# Altium project OrangeCrab.PrjPcb (part 1 of 2)
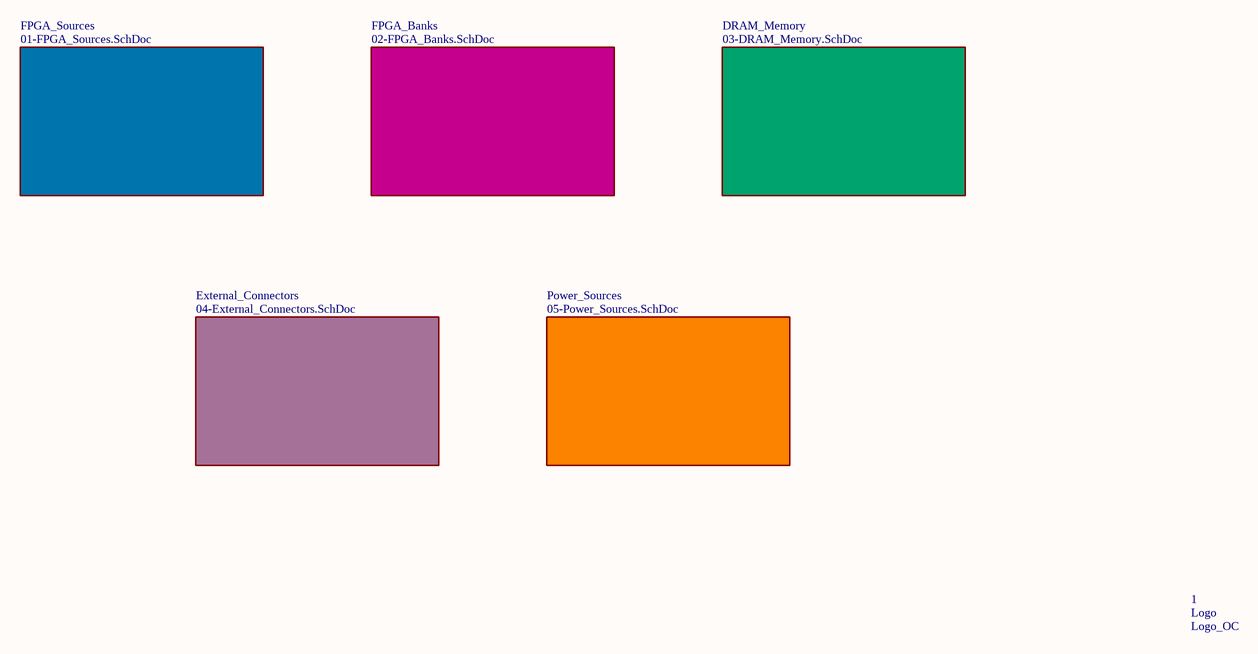
[diagram p0: 00-Hierarchy.SchDoc]
6 sheets, 143 parts. Net scope: global (net labels, ports and power ports of the same name join across sheets).
Board file: PCB_Design.PcbDoc
Sheets:
  00-Hierarchy.SchDoc
    FPGA_Sources = 01-FPGA_Sources.SchDoc
    FPGA_Banks = 02-FPGA_Banks.SchDoc
    DRAM_Memory = 03-DRAM_Memory.SchDoc
    External_Connectors = 04-External_Connectors.SchDoc
    Power_Sources = 05-Power_Sources.SchDoc

## Sheet 00-Hierarchy.SchDoc
size A4; Author: Fabian Castaño; CompanyName: GIBIC Tech-Hub; Engineer: Fabian Castaño; Organization: Universidad de Antioquia; Address1: UdeA; Address2: Medellín; Address3: Antioquia; Address4: Colombia 050010

### Parts
1  Logo_OC  [PCBComponent_1]

### Sub-sheets
DRAM_Memory = 03-DRAM_Memory.SchDoc: no entries
External_Connectors = 04-External_Connectors.SchDoc: no entries
FPGA_Banks = 02-FPGA_Banks.SchDoc: no entries
FPGA_Sources = 01-FPGA_Sources.SchDoc: no entries
Power_Sources = 05-Power_Sources.SchDoc: no entries

### Notes on the sheet
- Title
- Size:
- Date:
- A4
- Enginner:
- Time:
- Revision:
- Sheet
- of
- Author:
- File:
- (in symbol Logo_OC) Logo

## Sheet 01-FPGA_Sources.SchDoc
size A4; Author: Fabian Castaño; CompanyName: GIBIC Tech-Hub; Engineer: Fabian Castaño; Organization: Universidad de Antioquia; Address1: UdeA; Address2: Medellín; Address3: Antioquia; Address4: Colombia 050010
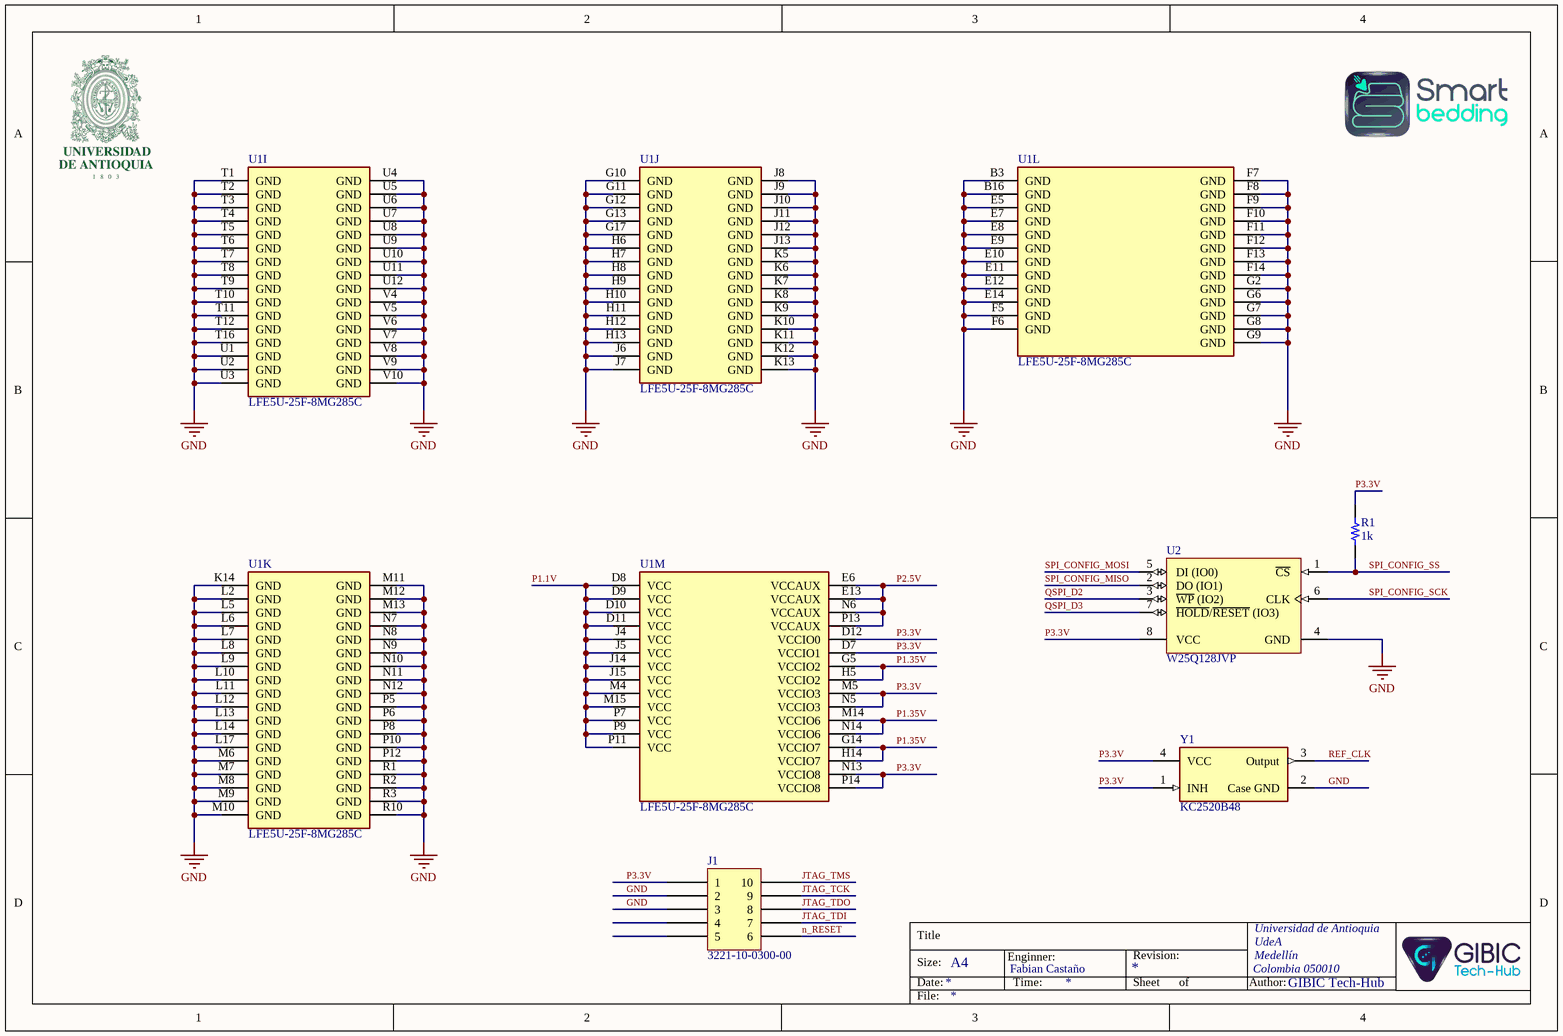
[diagram p1: 01-FPGA_Sources.SchDoc]

### Parts
J1  3221-10-0300-00  [CNC TECH 3221-10-0300-00]
R1  1k  [RES 0201_0603]
U1  LFE5U-25F-8MG285C  [FP-cBGA-LFE5U]  (parts I,J,K,L,M of 13)
U2  W25Q128JVP  [SON127P500X600X80-9N]
Y1  KC2520B48  [FP-KC2520B-MFG]

### Nets
GND: J1.2 J1.3 U1.B3(GND) U1.B16(GND) U1.E5(GND) U1.E7(GND) U1.E8(GND) U1.E9(GND) U1.E10(GND) U1.E11(GND) U1.E12(GND) U1.E14(GND) U1.F5(GND) U1.F6(GND) U1.F7(GND) U1.F8(GND) U1.F9(GND) U1.F10(GND) U1.F11(GND) U1.F12(GND) U1.F13(GND) U1.F14(GND) U1.G2(GND) U1.G6(GND) U1.G7(GND) U1.G8(GND) U1.G9(GND) U1.G10(GND) U1.G11(GND) U1.G12(GND) U1.G13(GND) U1.G17(GND) U1.H6(GND) U1.H7(GND) U1.H8(GND) U1.H9(GND) U1.H10(GND) U1.H11(GND) U1.H12(GND) U1.H13(GND) U1.J6(GND) U1.J7(GND) U1.J8(GND) U1.J9(GND) U1.J10(GND) U1.J11(GND) U1.J12(GND) U1.J13(GND) U1.K5(GND) U1.K6(GND) U1.K7(GND) U1.K8(GND) U1.K9(GND) U1.K10(GND) U1.K11(GND) U1.K12(GND) U1.K13(GND) U1.K14(GND) U1.L2(GND) U1.L5(GND) U1.L6(GND) U1.L7(GND) U1.L8(GND) U1.L9(GND) U1.L10(GND) U1.L11(GND) U1.L12(GND) U1.L13(GND) U1.L14(GND) U1.L17(GND) U1.M6(GND) U1.M7(GND) U1.M8(GND) U1.M9(GND) U1.M10(GND) U1.M11(GND) U1.M12(GND) U1.M13(GND) U1.N7(GND) U1.N8(GND) U1.N9(GND) U1.N10(GND) U1.N11(GND) U1.N12(GND) U1.P5(GND) U1.P6(GND) U1.P8(GND) U1.P10(GND) U1.P12(GND) U1.R1(GND) U1.R2(GND) U1.R3(GND) U1.R10(GND) U1.T1(GND) U1.T2(GND) U1.T3(GND) U1.T4(GND) U1.T5(GND) U1.T6(GND) U1.T7(GND) U1.T8(GND) U1.T9(GND) U1.T10(GND) U1.T11(GND) U1.T12(GND) U1.T16(GND) U1.U1(GND) U1.U2(GND) U1.U3(GND) U1.U4(GND) U1.U5(GND) U1.U6(GND) U1.U7(GND) U1.U8(GND) U1.U9(GND) U1.U10(GND) U1.U11(GND) U1.U12(GND) U1.V4(GND) U1.V5(GND) U1.V6(GND) U1.V7(GND) U1.V8(GND) U1.V9(GND) U1.V10(GND) U2.4(GND) Y1.2(Case_GND)
JTAG_TCK: J1.9
JTAG_TDI: J1.7
JTAG_TDO: J1.8
JTAG_TMS: J1.10
n_RESET: J1.6
P1.1V: U1.D8(VCC) U1.D9(VCC) U1.D10(VCC) U1.D11(VCC) U1.J4(VCC) U1.J5(VCC) U1.J14(VCC) U1.J15(VCC) U1.M4(VCC) U1.M15(VCC) U1.P7(VCC) U1.P9(VCC) U1.P11(VCC)
P1.35V: U1.G5(VCCIO2) U1.G14(VCCIO7) U1.H5(VCCIO2) U1.H14(VCCIO7) U1.M14(VCCIO6) U1.N14(VCCIO6)
P2.5V: U1.E6(VCCAUX) U1.E13(VCCAUX) U1.N6(VCCAUX) U1.P13(VCCAUX)
P3.3V: J1.1 R1.1 U1.D7(VCCIO1) U1.D12(VCCIO0) U1.M5(VCCIO3) U1.N5(VCCIO3) U1.N13(VCCIO8) U1.P14(VCCIO8) U2.8(VCC) Y1.1(INH) Y1.4(VCC)
QSPI_D2: U2.3(~{WP}_(IO2))
QSPI_D3: U2.7(~{HOLD}/~{RESET}_(IO3))
REF_CLK: Y1.3(Output)
SPI_CONFIG_MISO: U2.2(DO_(IO1))
SPI_CONFIG_MOSI: U2.5(DI_(IO0))
SPI_CONFIG_SCK: U2.6(CLK)
SPI_CONFIG_SS: R1.2 U2.1(~{CS})

Not connected (* = marked no-connect by the designer): J1 4 5

### Notes on the sheet
- Title
- Size:
- Date:
- A4
- Enginner:
- Time:
- Revision:
- Sheet
- of
- Author:
- File:

### Library data of the parts
J1 = 3221-10-0300-00: CONN HEADER SMD 10POS 1.27MM; Manufacturer: CNC Tech; Current Rating (Amps): 1A; Material Flammability Rating: UL94 V-0; Number of Positions: 10; Number of Positions Loaded: All; Pitch - Mating: 0.050" (1.27mm); Shrouding: Shrouded - 4 Wall; Style: Board to Cable/Wire; Part Number: 3221-10-0300-00; ComponentLink1Description: Datasheet; ComponentLink1URL: http://cnctech.us/idcmatching2.pdf; ComponentLink2Description: DigiKey Link; ComponentLink2URL: http://digikey.com/product-detail/en/cnc-tech/3221-10-0300-00/1175-1735-ND/4878946; Connector Type: Header; Contact Finish - Mating: Gold; Contact Finish - Post: Gold; Contact Finish Thickness - Mating: Flash; Contact Material: Brass; Contact Shape: Square; Contact Type: Male Pin; Fastening Type: Push-Pull; Features: Keying Slot; Insulation Height: 0.213" (5.40mm); Insulation Material: Polyamide (PA6T), Nylon 6T; LastUpdated: 13/01/2020 12:09:21 a. m.; Lifecycle Status: Active; Minimum Order: 1; Mounting Type: Surface Mount; Number of Rows: 2; Operating Temperature: -40°C ~ 105°C; Packaging: Tray; PartId: 109; Part Status: Active; Price: 0.73; Row Spacing - Mating: 0.050" (1.27mm); Series: -; Supplier 1: DigiKey; Supplier Part Number 1: 1175-1735-ND; Termination: Solder
R1 = ERA-1AEB103C: RES SMD 10K OHM 0.1% 1/20W 0201; Manufacturer: Panasonic Electronic Components; Power (Watts): 0.05W, 1/20W; Resistance: 10 kOhms; Temperature Coefficient: ±25ppm/°C; Part Number: ERA-1AEB103C; Value: 1k; ComponentLink1Description: Datasheet; ComponentLink1URL: https://industrial.panasonic.com/cdbs/www-data/pdf/RDM0000/AOA0000C307.pdf; ComponentLink2Description: DigiKey Link; ComponentLink2URL: https://www.digikey.com/en/products/detail/panasonic-electronic-components/ERA-1AEB103C/5035568; Composition: Thin Film; Device Package: 0201 (0603 Metric); Features: Automotive AEC-Q200; Height - Seated (Max): 0.010" (0.26mm); LastUpdated: 3/01/2023 8:15:23 p. m.; Lifecycle Status: Active; Minimum Order: 1; Number of Terminations: 2; Operating Temperature: -55°C ~ 155°C; Package / Case: 0201 (0603 Metric); Packaging: TapeAndReel; PartId: 598; Part Status: Active; Price: 0.06; Ratings: AEC-Q200; Series: ERA-1A; Size / Dimension: 0.024" L x 0.012" W (0.60mm x 0.30mm); Supplier 1: DigiKey; Supplier Part Number 1: P10KBXCT-ND; Supplier Device Package: 0201; Tolerance: ±0.1%
U1 = LFE5U-25F-8MG285C: FPGA LatticeECP5 Family 24000 Cells 40nm Technology 1.1V 285-Pin CSFBGA
U2 = W25Q128JVP: FLASH - NOR Memory IC 128Mb (16M x 8) SPI - Quad I/O, QPI, DTR 133 MHz 8-WSON (6x5)

## Sheet 02-FPGA_Banks.SchDoc
size A4; Author: Fabian Castaño; CompanyName: GIBIC Tech-Hub; Engineer: Fabian Castaño; Organization: Universidad de Antioquia; Address1: UdeA; Address2: Medellín; Address3: Antioquia; Address4: Colombia 050010
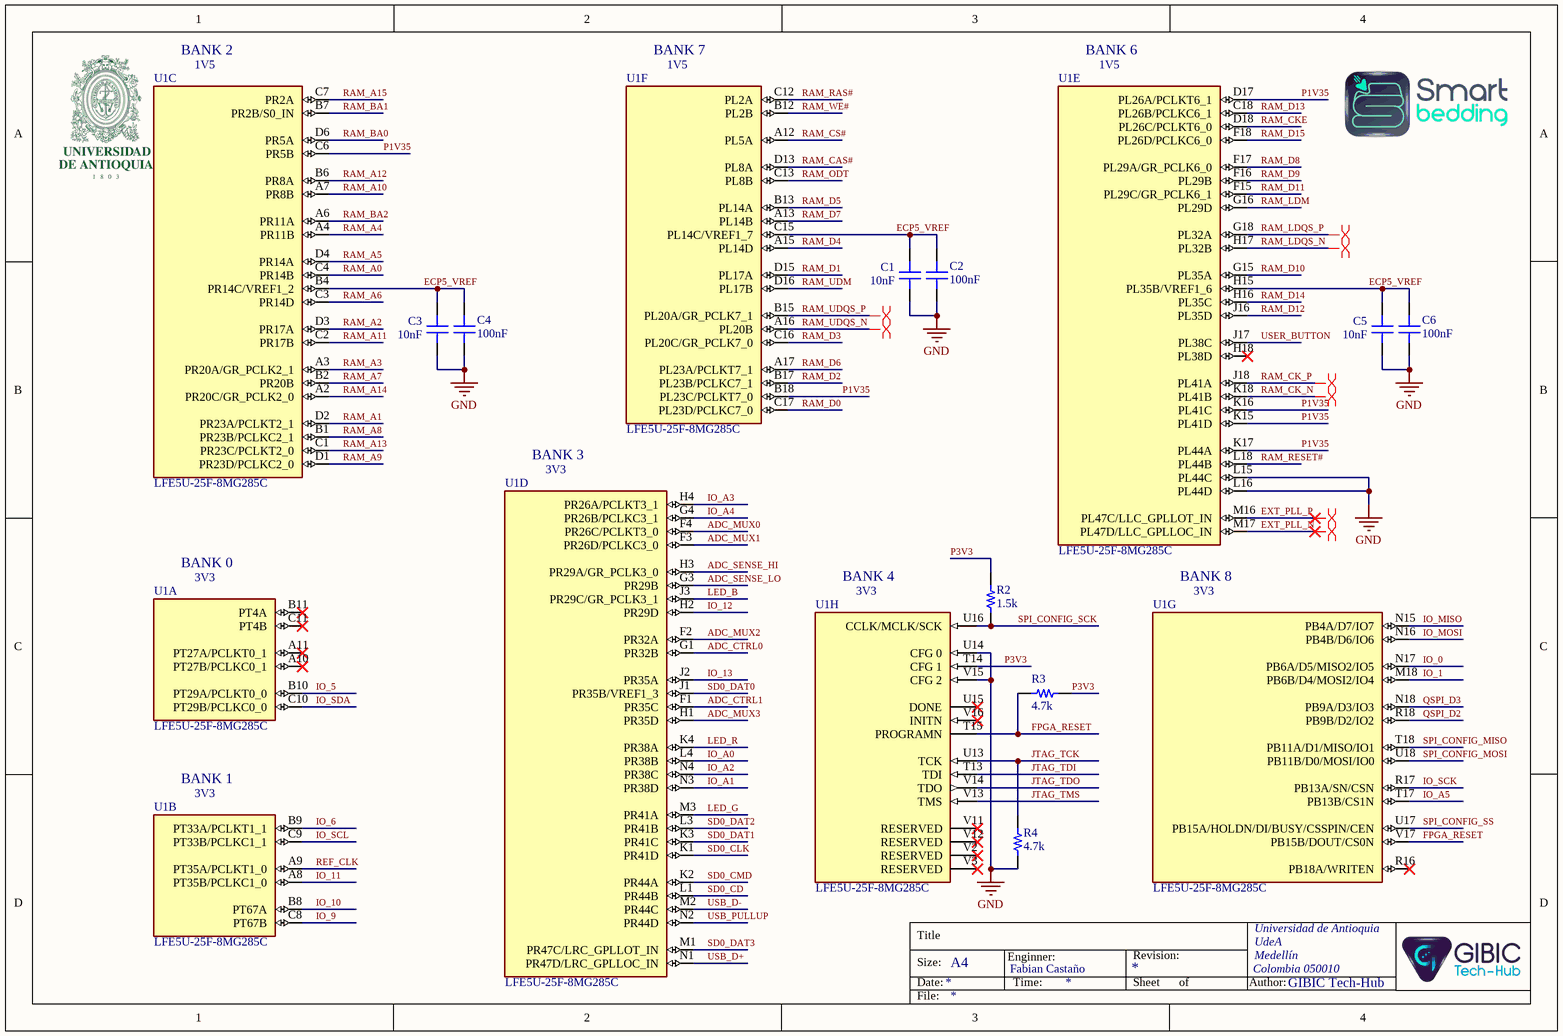
[diagram p2: 02-FPGA_Banks.SchDoc]

### Parts
C1  10nF  [CAP 0201_0603]
C2  100nF  [CAP 0201_0603]
C3  10nF  [CAP 0201_0603]
C4  100nF  [CAP 0201_0603]
C5  10nF  [CAP 0201_0603]
C6  100nF  [CAP 0201_0603]
R2  1.5k  [RES 0201_0603]
R3  4.7k  [RES 0201_0603]
R4  4.7k  [RES 0201_0603]
U1  LFE5U-25F-8MG285C  [FP-cBGA-LFE5U]  (parts A,B,C,D,E,F,G,H of 13)

### Nets
GND: C1.1 C2.1 C3.1 C4.1 C5.1 C6.1 R4.2 U1.L15(PL44C) U1.L16(PL44D) U1.U14(CFG_0) U1.V15(CFG_2)
ADC_CTRL0: U1.G1(PR32B)
ADC_CTRL1: U1.F1(PR35C)
ADC_MUX0: U1.F4(PR26C/PCLKT3_0)
ADC_MUX1: U1.F3(PR26D/PCLKC3_0)
ADC_MUX2: U1.F2(PR32A)
ADC_MUX3: U1.H1(PR35D)
ADC_SENSE_HI: U1.H3(PR29A/GR_PCLK3_0)
ADC_SENSE_LO: U1.G3(PR29B)
ECP5_VREF: C1.2 C2.2 C3.2 C4.2 C5.2 C6.2 U1.B4(PR14C/VREF1_2) U1.C15(PL14C/VREF1_7) U1.H15(PL35B/VREF1_6)
EXT_PLL_N: U1.M17(PL47D/LLC_GPLLOC_IN)
EXT_PLL_P: U1.M16(PL47C/LLC_GPLLOT_IN)
FPGA_RESET: R3.2 U1.T15(PROGRAMN) U1.V17(PB15B/DOUT/CS0N)
IO_0: U1.N17(PB6A/D5/MISO2/IO5)
IO_1: U1.M18(PB6B/D4/MOSI2/IO4)
IO_5: U1.B10(PT29A/PCLKT0_0)
IO_6: U1.B9(PT33A/PCLKT1_1)
IO_9: U1.C8(PT67B)
IO_10: U1.B8(PT67A)
IO_11: U1.A8(PT35B/PCLKC1_0)
IO_12: U1.H2(PR29D)
IO_13: U1.J2(PR35A)
IO_A0: U1.L4(PR38B)
IO_A1: U1.N3(PR38D)
IO_A2: U1.N4(PR38C)
IO_A3: U1.H4(PR26A/PCLKT3_1)
IO_A4: U1.G4(PR26B/PCLKC3_1)
IO_A5: U1.T17(PB13B/CS1N)
IO_MISO: U1.N15(PB4A/D7/IO7)
IO_MOSI: U1.N16(PB4B/D6/IO6)
IO_SCK: U1.R17(PB13A/SN/CSN)
IO_SCL: U1.C9(PT33B/PCLKC1_1)
IO_SDA: U1.C10(PT29B/PCLKC0_0)
JTAG_TCK: R4.1 U1.U13(TCK)
JTAG_TDI: U1.T13(TDI)
JTAG_TDO: U1.V14(TDO)
JTAG_TMS: U1.V13(TMS)
LED_B: U1.J3(PR29C/GR_PCLK3_1)
LED_G: U1.M3(PR41A)
LED_R: U1.K4(PR38A)
P1V35: U1.B18(PL23C/PCLKT7_0) U1.C6(PR5B) U1.D17(PL26A/PCLKT6_1) U1.K15(PL41D) U1.K16(PL41C) U1.K17(PL44A)
P3V3: R2.1 R3.1 U1.T14(CFG_1)
QSPI_D2: U1.R18(PB9B/D2/IO2)
QSPI_D3: U1.N18(PB9A/D3/IO3)
RAM_A0: U1.C4(PR14B)
RAM_A1: U1.D2(PR23A/PCLKT2_1)
RAM_A2: U1.D3(PR17A)
RAM_A3: U1.A3(PR20A/GR_PCLK2_1)
RAM_A4: U1.A4(PR11B)
RAM_A5: U1.D4(PR14A)
RAM_A6: U1.C3(PR14D)
RAM_A7: U1.B2(PR20B)
RAM_A8: U1.B1(PR23B/PCLKC2_1)
RAM_A9: U1.D1(PR23D/PCLKC2_0)
RAM_A10: U1.A7(PR8B)
RAM_A11: U1.C2(PR17B)
RAM_A12: U1.B6(PR8A)
RAM_A13: U1.C1(PR23C/PCLKT2_0)
RAM_A14: U1.A2(PR20C/GR_PCLK2_0)
RAM_A15: U1.C7(PR2A)
RAM_BA0: U1.D6(PR5A)
RAM_BA1: U1.B7(PR2B/S0_IN)
RAM_BA2: U1.A6(PR11A)
RAM_CAS#: U1.D13(PL8A)
RAM_CK_N: U1.K18(PL41B)
RAM_CK_P: U1.J18(PL41A)
RAM_CKE: U1.D18(PL26C/PCLKT6_0)
RAM_CS#: U1.A12(PL5A)
RAM_D0: U1.C17(PL23D/PCLKC7_0)
RAM_D1: U1.D15(PL17A)
RAM_D2: U1.B17(PL23B/PCLKC7_1)
RAM_D3: U1.C16(PL20C/GR_PCLK7_0)
RAM_D4: U1.A15(PL14D)
RAM_D5: U1.B13(PL14A)
RAM_D6: U1.A17(PL23A/PCLKT7_1)
RAM_D7: U1.A13(PL14B)
RAM_D8: U1.F17(PL29A/GR_PCLK6_0)
RAM_D9: U1.F16(PL29B)
RAM_D10: U1.G15(PL35A)
RAM_D11: U1.F15(PL29C/GR_PCLK6_1)
RAM_D12: U1.J16(PL35D)
RAM_D13: U1.C18(PL26B/PCLKC6_1)
RAM_D14: U1.H16(PL35C)
RAM_D15: U1.F18(PL26D/PCLKC6_0)
RAM_LDM: U1.G16(PL29D)
RAM_LDQS_N: U1.H17(PL32B)
RAM_LDQS_P: U1.G18(PL32A)
RAM_ODT: U1.C13(PL8B)
RAM_RAS#: U1.C12(PL2A)
RAM_RESET#: U1.L18(PL44B)
RAM_UDM: U1.D16(PL17B)
RAM_UDQS_N: U1.A16(PL20B)
RAM_UDQS_P: U1.B15(PL20A/GR_PCLK7_1)
RAM_WE#: U1.B12(PL2B)
REF_CLK: U1.A9(PT35A/PCLKT1_0)
SD0_CD: U1.L1(PR44B)
SD0_CLK: U1.K1(PR41D)
SD0_CMD: U1.K2(PR44A)
SD0_DAT0: U1.J1(PR35B/VREF1_3)
SD0_DAT1: U1.K3(PR41C)
SD0_DAT2: U1.L3(PR41B)
SD0_DAT3: U1.M1(PR47C/LRC_GPLLOT_IN)
SPI_CONFIG_MISO: U1.T18(PB11A/D1/MISO/IO1)
SPI_CONFIG_MOSI: U1.U18(PB11B/D0/MOSI/IO0)
SPI_CONFIG_SCK: R2.2 U1.U16(CCLK/MCLK/SCK)
SPI_CONFIG_SS: U1.U17(PB15A/HOLDN/DI/BUSY/CSSPIN/CEN)
USB_D+: U1.N1(PR47D/LRC_GPLLOC_IN)
USB_D-: U1.M2(PR44C)
USB_PULLUP: U1.N2(PR44D)
USER_BUTTON: U1.J17(PL38C)

Not connected (* = marked no-connect by the designer): U1 A10(PT27B/PCLKC0_1)* A11(PT27A/PCLKT0_1)* B11(PT4A)* C11(PT4B)* H18(PL38D)* R16(PB18A/WRITEN)* U15(DONE)* V2(RESERVED)* V3(RESERVED)* V11(RESERVED)* V12(RESERVED)* V16(INITN)*

### Layout directives
differential pair: EXT_PLL_N, EXT_PLL_P, RAM_CK_N, RAM_CK_P, RAM_LDQS_N, RAM_LDQS_P, RAM_UDQS_N, RAM_UDQS_P

### Notes on the sheet
- BANK 2
- 1V5
- BANK 7
- BANK 6
- BANK 3
- 3V3
- BANK 0
- BANK 4
- (near U1) BANK 8
- BANK 1
- Title
- Size:
- Date:
- A4
- Enginner:
- Time:
- Revision:
- Sheet
- of
- Author:
- File:

### Library data of the parts
C1 C3 C5 = 0201ZC103JAT2A: CAP CER 10000PF 10V X7R 0201; manufacturer: AVX Corporation; Tolerance: ±5%; Part Number: 0201ZC103JAT2A; Value: 10nF; Applications: General Purpose; Capacitance: 10000pF; componentlink1description: Datasheet; componentlink1url: http://datasheets.avx.com/X7RDielectric.pdf; componentlink2description: DigiKey Link; componentlink2url: http://digikey.com/product-detail/en/avx-corporation/0201ZC103JAT2A/478-10776-1-ND/7536320; Device Package: 0201 (0603 Metric); lastupdated: 2/09/2020 12:59:12 a. m.; Lifecycle Status: Active; Minimum Order: 1; Mounting Type: Surface Mount, MLCC; Operating Temperature: -55°C ~ 125°C; Package / Case: 0201 (0603 Metric); packaging: TapeAndReel; partid: 786; Part Status: Active; price: 0.01; series: -; Size / Dimension: 0.024" L x 0.012" W (0.60mm x 0.30mm); Supplier 1: DigiKey; Supplier Part Number 1: 478-10776-1-ND; Temperature Coefficient: X7R; Thickness (Max): 0.013" (0.33mm); Voltage - Rated: 10V
C2 C4 C6 = GRT033C80J104KE01J: CAP CER 0.1UF 6.3V X6S 0201; manufacturer: Murata Electronics; Capacitance: 0.1 µF; Tolerance: ±10%; Part Number: GRT033C80J104KE01J; Value: 100nF; Applications: Automotive; componentlink1description: Datasheet; componentlink1url: https://search.murata.co.jp/Ceramy/image/img/A01X/G101/ENG/GRT033C80J104KE01-01.pdf; componentlink2description: DigiKey Link; componentlink2url: https://www.digikey.com/en/products/detail/murata-electronics/GRT033C80J104KE01J/13905086; Device Package: 0201 (0603 Metric); lastupdated: 3/01/2023 8:00:58 p. m.; Lifecycle Status: Active; Minimum Order: 1; Mounting Type: Surface Mount, MLCC; Operating Temperature: -55°C ~ 105°C; Package / Case: 0201 (0603 Metric); packaging: CutTape; partid: 29730; Part Status: Active; price: 0.01; Ratings: AEC-Q200; series: GRT; Size / Dimension: 0.024" L x 0.012" W (0.60mm x 0.30mm); Supplier 1: DigiKey; Supplier Part Number 1: 490-GRT033C80J104KE01JCT-ND; Temperature Coefficient: X6S; Thickness (Max): 0.013" (0.33mm); Voltage - Rated: 6.3V
R2-R4 = ERA-1AEB103C: as R1 on sheet 01-FPGA_Sources; Part Number: ERA-1AEB103C; ComponentLink1Description: Datasheet; ComponentLink1URL: https://industrial.panasonic.com/cdbs/www-data/pdf/RDM0000/AOA0000C307.pdf; ComponentLink2Description: DigiKey Link; ComponentLink2URL: https://www.digikey.com/en/products/detail/panasonic-electronic-components/ERA-1AEB103C/5035568; Composition: Thin Film; Device Package: 0201 (0603 Metric); Features: Automotive AEC-Q200; Height - Seated (Max): 0.010" (0.26mm); LastUpdated: 3/01/2023 8:15:23 p. m.; Lifecycle Status: Active; Minimum Order: 1; Number of Terminations: 2; Operating Temperature: -55°C ~ 155°C; Package / Case: 0201 (0603 Metric); Packaging: TapeAndReel; PartId: 598; Part Status: Active; Price: 0.06; Ratings: AEC-Q200; Series: ERA-1A; Size / Dimension: 0.024" L x 0.012" W (0.60mm x 0.30mm); Supplier 1: DigiKey; Supplier Part Number 1: P10KBXCT-ND; Supplier Device Package: 0201; Tolerance: ±0.1%
  R2: Value: 1.5k
  R3 R4: Value: 4.7k
U1 = LFE5U-25F-8MG285C: as U1 on sheet 01-FPGA_Sources

## Sheet 03-DRAM_Memory.SchDoc
size A4; Author: Fabian Castaño; CompanyName: GIBIC Tech-Hub; Engineer: Fabian Castaño; Organization: Universidad de Antioquia; Address1: UdeA; Address2: Medellín; Address3: Antioquia; Address4: Colombia 050010
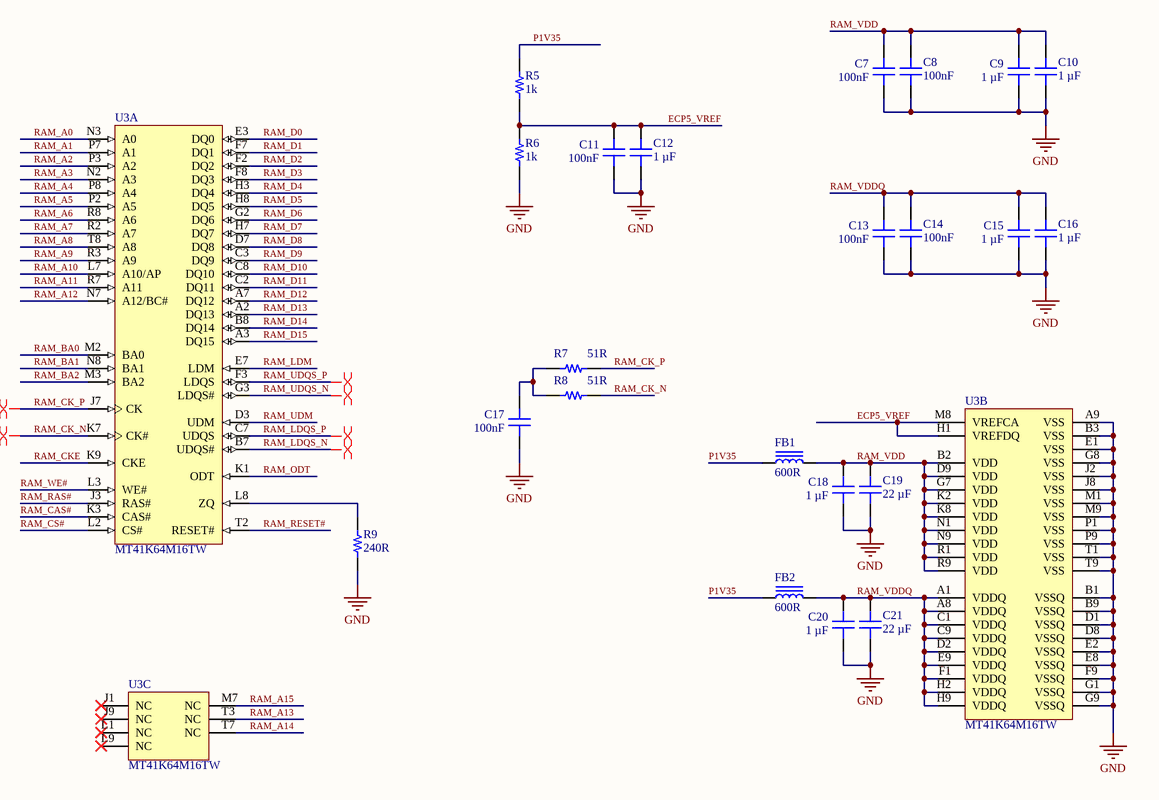
[diagram p3: 03-DRAM_Memory.SchDoc]

### Parts
C7  100nF  [CAP 0201_0603]
C8  100nF  [CAP 0201_0603]
C9  1 µF  [CAP 0402_1005]
C10  1 µF  [CAP 0402_1005]
C11  100nF  [CAP 0201_0603]
C12  1 µF  [CAP 0402_1005]
C13  100nF  [CAP 0201_0603]
C14  100nF  [CAP 0201_0603]
C15  1 µF  [CAP 0402_1005]
C16  1 µF  [CAP 0402_1005]
C17  100nF  [CAP 0201_0603]
C18  1 µF  [CAP 0402_1005]
C19  22 µF  [CAP 0603_1608]
C20  1 µF  [CAP 0402_1005]
C21  22 µF  [CAP 0603_1608]
FB1  600R  [IND 0402_1005 RF WW]
FB2  600R  [IND 0402_1005 RF WW]
R5  1k  [RES 0201_0603]
R6  1k  [RES 0201_0603]
R7  51R  [RES 0201_0603]
R8  51R  [RES 0201_0603]
R9  240R  [RES 0402_1005]
U3  MT41K64M16TW  [MICT-TW-96]  (parts A,B,C of 3)

### Nets
GND: C7.1 C8.1 C9.1 C10.1 C11.1 C12.1 C13.1 C14.1 C15.1 C16.1 C17.1 C18.1 C19.1 C20.1 C21.1 R6.2 R9.1 U3.A9(VSS) U3.B1(VSSQ) U3.B3(VSS) U3.B9(VSSQ) U3.D1(VSSQ) U3.D8(VSSQ) U3.E1(VSS) U3.E2(VSSQ) U3.E8(VSSQ) U3.F9(VSSQ) U3.G1(VSSQ) U3.G8(VSS) U3.G9(VSSQ) U3.J2(VSS) U3.J8(VSS) U3.M1(VSS) U3.M9(VSS) U3.P1(VSS) U3.P9(VSS) U3.T1(VSS) U3.T9(VSS)
ECP5_VREF: C11.2 C12.2 R5.2 R6.1 U3.H1(VREFDQ) U3.M8(VREFCA)
P1V35: FB1.1 FB2.1 R5.1
RAM_A0: U3.N3(A0)
RAM_A1: U3.P7(A1)
RAM_A2: U3.P3(A2)
RAM_A3: U3.N2(A3)
RAM_A4: U3.P8(A4)
RAM_A5: U3.P2(A5)
RAM_A6: U3.R8(A6)
RAM_A7: U3.R2(A7)
RAM_A8: U3.T8(A8)
RAM_A9: U3.R3(A9)
RAM_A10: U3.L7(A10/AP)
RAM_A11: U3.R7(A11)
RAM_A12: U3.N7(A12/BC#)
RAM_A13: U3.T3(NC)
RAM_A14: U3.T7(NC)
RAM_A15: U3.M7(NC)
RAM_BA0: U3.M2(BA0)
RAM_BA1: U3.N8(BA1)
RAM_BA2: U3.M3(BA2)
RAM_CAS#: U3.K3(CAS#)
RAM_CK_N: R8.2 U3.K7(CK#)
RAM_CK_P: R7.2 U3.J7(CK)
RAM_CKE: U3.K9(CKE)
RAM_CS#: U3.L2(CS#)
RAM_D0: U3.E3(DQ0)
RAM_D1: U3.F7(DQ1)
RAM_D2: U3.F2(DQ2)
RAM_D3: U3.F8(DQ3)
RAM_D4: U3.H3(DQ4)
RAM_D5: U3.H8(DQ5)
RAM_D6: U3.G2(DQ6)
RAM_D7: U3.H7(DQ7)
RAM_D8: U3.D7(DQ8)
RAM_D9: U3.C3(DQ9)
RAM_D10: U3.C8(DQ10)
RAM_D11: U3.C2(DQ11)
RAM_D12: U3.A7(DQ12)
RAM_D13: U3.A2(DQ13)
RAM_D14: U3.B8(DQ14)
RAM_D15: U3.A3(DQ15)
RAM_LDM: U3.E7(LDM)
RAM_LDQS_N: U3.B7(UDQS#)
RAM_LDQS_P: U3.C7(UDQS)
RAM_ODT: U3.K1(ODT)
RAM_RAS#: U3.J3(RAS#)
RAM_RESET#: U3.T2(RESET#)
RAM_UDM: U3.D3(UDM)
RAM_UDQS_N: U3.G3(LDQS#)
RAM_UDQS_P: U3.F3(LDQS)
RAM_VDD: C7.2 C8.2 C9.2 C10.2 C18.2 C19.2 FB1.2 U3.B2(VDD) U3.D9(VDD) U3.G7(VDD) U3.K2(VDD) U3.K8(VDD) U3.N1(VDD) U3.N9(VDD) U3.R1(VDD) U3.R9(VDD)
RAM_VDDQ: C13.2 C14.2 C15.2 C16.2 C20.2 C21.2 FB2.2 U3.A1(VDDQ) U3.A8(VDDQ) U3.C1(VDDQ) U3.C9(VDDQ) U3.D2(VDDQ) U3.E9(VDDQ) U3.F1(VDDQ) U3.H2(VDDQ) U3.H9(VDDQ)
RAM_WE#: U3.L3(WE#)
NetC17_2: C17.2 R7.1 R8.1
NetR9_2: R9.2 U3.L8(ZQ)

Not connected (* = marked no-connect by the designer): U3 J1(NC)* J9(NC)* L1(NC)* L9(NC)*

### Layout directives
differential pair: RAM_CK_N, RAM_CK_P, RAM_LDQS_N, RAM_LDQS_P, RAM_UDQS_N, RAM_UDQS_P

### Notes on the sheet
- Title
- Size:
- Date:
- A4
- Enginner:
- Time:
- Revision:
- Sheet
- of
- Author:
- File:

### Library data of the parts
C7 C8 C11 C13 C14 C17 = GRT033C80J104KE01J: as C2 on sheet 02-FPGA_Banks; Part Number: GRT033C80J104KE01J; Value: 100nF; Applications: Automotive; componentlink1description: Datasheet; componentlink1url: https://search.murata.co.jp/Ceramy/image/img/A01X/G101/ENG/GRT033C80J104KE01-01.pdf; componentlink2description: DigiKey Link; componentlink2url: https://www.digikey.com/en/products/detail/murata-electronics/GRT033C80J104KE01J/13905086; Device Package: 0201 (0603 Metric); lastupdated: 3/01/2023 8:00:58 p. m.; Lifecycle Status: Active; Minimum Order: 1; Mounting Type: Surface Mount, MLCC; Operating Temperature: -55°C ~ 105°C; Package / Case: 0201 (0603 Metric); packaging: CutTape; partid: 29730; Part Status: Active; price: 0.01; Ratings: AEC-Q200; series: GRT; Size / Dimension: 0.024" L x 0.012" W (0.60mm x 0.30mm); Supplier 1: DigiKey; Supplier Part Number 1: 490-GRT033C80J104KE01JCT-ND; Temperature Coefficient: X6S; Thickness (Max): 0.013" (0.33mm); Voltage - Rated: 6.3V
C9 C10 C12 C15 C16 C18 C20 = LMK105C6105KV-F: CAP CER 1UF 10V X6S 0402; manufacturer: Taiyo Yuden; Tolerance: ±10%; Part Number: LMK105C6105KV-F; Value: 1 µF; Applications: SMPS Filtering; Capacitance: 1 µF; componentlink1description: Datasheet; componentlink1url: https://www.yuden.co.jp/productdata/catalog/mlcc01_e.pdf; componentlink2description: DigiKey Link; componentlink2url: https://www.digikey.com/en/products/detail/taiyo-yuden/LMK105C6105KV-F/4157226; Device Package: 0402 (1005 Metric); lastupdated: 3/01/2023 8:04:17 p. m.; Lifecycle Status: Active; Minimum Order: 1; Mounting Type: Surface Mount, MLCC; Operating Temperature: -55°C ~ 105°C; Package / Case: 0402 (1005 Metric); packaging: TapeAndReel; partid: 2215; Part Status: Active; price: 0.01; series: M; Size / Dimension: 0.039" L x 0.020" W (1.00mm x 0.50mm); Supplier 1: DigiKey; Supplier Part Number 1: 587-3409-1-ND; Temperature Coefficient: X6S; Thickness (Max): 0.022" (0.55mm); Voltage - Rated: 10V
C19 C21 = GRM186R60J226ME15D: CAP CER 22UF 6.3V X5R 0603; manufacturer: Murata Electronics; Tolerance: ±20%; Part Number: GRM186R60J226ME15D; Value: 22 µF; Applications: General Purpose; Capacitance: 22 µF; componentlink1description: Datasheet; componentlink1url: https://psearch.en.murata.com/capacitor/product/GRM186R60J226ME15%23.pdf; componentlink2description: DigiKey Link; componentlink2url: https://www.digikey.com/en/products/detail/murata-electronics/GRM186R60J226ME15D/5877404; Device Package: 0603 (1608 Metric); lastupdated: 3/01/2023 8:07:48 p. m.; Lifecycle Status: Active; Minimum Order: 1; Mounting Type: Surface Mount, MLCC; Operating Temperature: -55°C ~ 85°C; Package / Case: 0603 (1608 Metric); packaging: TapeAndReel; partid: 2353; Part Status: Active; price: 0.06; series: GRM; Size / Dimension: 0.063" L x 0.031" W (1.60mm x 0.80mm); Supplier 1: DigiKey; Supplier Part Number 1: 490-13241-1-ND; Temperature Coefficient: X5R; Thickness (Max): 0.024" (0.60mm); Voltage - Rated: 6.3V
FB1 FB2 = LQW15AN4N8D8ZD: FIXED IND 4.8NH 1.2A 71MOHM SMD; Manufacturer: Murata Electronics; DC Resistance (DCR): 71mOhm Max; Frequency - Self Resonant: 8GHz; Inductance Frequency - Test: 100 MHz; Material - Core: Non-Magnetic; Q @ Freq: 30 @ 250MHz; Shielding: Unshielded; Tolerance: ±0.5nH; Type: Wirewound; Part Number: LQW15AN4N8D8ZD; ComponentLink1Description: Datasheet; ComponentLink1URL: https://search.murata.co.jp/Ceramy/image/img/P02/JELF243A-9138.pdf; ComponentLink2Description: DigiKey Link; ComponentLink2URL: https://www.digikey.com/en/products/detail/murata-electronics/LQW15AN4N8D8ZD/6798910; Current Rating (Amps): 1.2 A; Device Package: 0402 (1005 Metric); Height - Seated (Max): 0.024" (0.60mm); Inductance: 4.8 nH; LastUpdated: 2/01/2023 8:59:34 p. m.; Lifecycle Status: Active; Minimum Order: 1; Mounting Type: Surface Mount; Operating Temperature: -55°C ~ 125°C; Package / Case: 0402 (1005 Metric); Packaging: TapeAndReel; PartId: 2; Part Status: Active; Price: 0.08; Ratings: AEC-Q200; Series: LQW15; Size / Dimension: 0.039" L x 0.024" W (1.00mm x 0.60mm); Supplier 1: DigiKey; Supplier Part Number 1: 490-15485-1-ND; Value: 600R
R5-R8 = ERA-1AEB103C: as R1 on sheet 01-FPGA_Sources; Part Number: ERA-1AEB103C; ComponentLink1Description: Datasheet; ComponentLink1URL: https://industrial.panasonic.com/cdbs/www-data/pdf/RDM0000/AOA0000C307.pdf; ComponentLink2Description: DigiKey Link; ComponentLink2URL: https://www.digikey.com/en/products/detail/panasonic-electronic-components/ERA-1AEB103C/5035568; Composition: Thin Film; Device Package: 0201 (0603 Metric); Features: Automotive AEC-Q200; Height - Seated (Max): 0.010" (0.26mm); LastUpdated: 3/01/2023 8:15:23 p. m.; Lifecycle Status: Active; Minimum Order: 1; Number of Terminations: 2; Operating Temperature: -55°C ~ 155°C; Package / Case: 0201 (0603 Metric); Packaging: TapeAndReel; PartId: 598; Part Status: Active; Price: 0.06; Ratings: AEC-Q200; Series: ERA-1A; Size / Dimension: 0.024" L x 0.012" W (0.60mm x 0.30mm); Supplier 1: DigiKey; Supplier Part Number 1: P10KBXCT-ND; Supplier Device Package: 0201; Tolerance: ±0.1%
  R5 R6: Value: 1k
  R7 R8: Value: 51R
R9 = ERJ-2RKF1240X: RES SMD 124 OHM 1% 1/10W 0402; Manufacturer: Panasonic Electronic Components; Power (Watts): 0.1W, 1/10W; Resistance: 124 Ohms; Temperature Coefficient: ±100ppm/°C; Part Number: ERJ-2RKF1240X; Value: 240R; ComponentLink1Description: Datasheet; ComponentLink1URL: https://industrial.panasonic.com/cdbs/www-data/pdf/RDA0000/AOA0000C304.pdf; ComponentLink2Description: DigiKey Link; ComponentLink2URL: https://www.digikey.com/en/products/detail/panasonic-electronic-components/ERJ-2RKF1240X/192112; Composition: Thick Film; Device Package: 0402 (1005 Metric); Features: Automotive AEC-Q200; Height - Seated (Max): 0.016" (0.40mm); LastUpdated: 2/01/2023 8:21:47 p. m.; Lifecycle Status: Active; Minimum Order: 1; Number of Terminations: 2; Operating Temperature: -55°C ~ 155°C; Package / Case: 0402 (1005 Metric); Packaging: CutTape; PartId: 3785; Part Status: Active; Price: 0.01; Ratings: AEC-Q200; Series: ERJ-2RK; Size / Dimension: 0.039" L x 0.020" W (1.00mm x 0.50mm); Supplier 1: DigiKey; Supplier Part Number 1: P124LCT-ND; Supplier Device Package: 0402; Tolerance: ±1%
U3 = MT41K64M16TW: DDR3L SDRAM, 8 Meg x 16 x 8 Bank, 1.07 ns, 0 to 95 degC, 96-Ball FBGA (TW), Pb-Free

## Sheet 04-External_Connectors.SchDoc
size A4; Author: Fabian Castaño; CompanyName: GIBIC Tech-Hub; Engineer: Fabian Castaño; Organization: Universidad de Antioquia; Address1: UdeA; Address2: Medellín; Address3: Antioquia; Address4: Colombia 050010
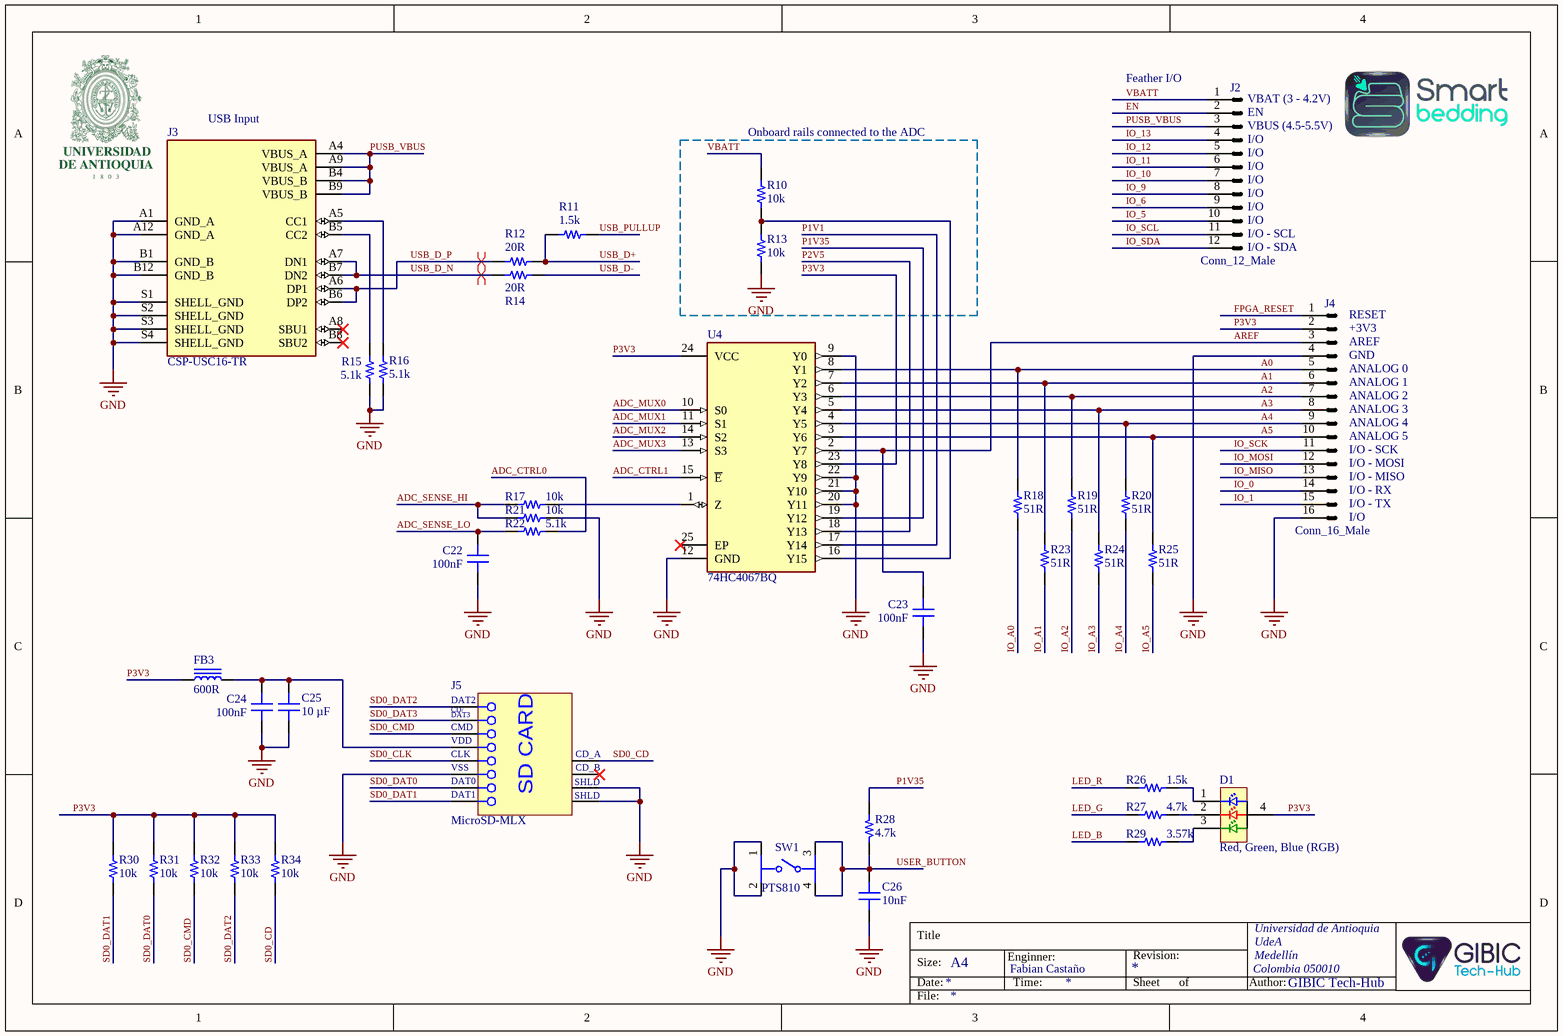
[diagram p4: 04-External_Connectors.SchDoc]

### Parts
C22  100nF  [CAP 0201_0603]
C23  100nF  [CAP 0201_0603]
C24  100nF  [CAP 0201_0603]
C25  10 µF  [CAP 0402_1005]
C26  10nF  [CAP 0201_0603]
D1  Red, Green, Blue (RGB)  [Citizen CL-505S-X-SD-T]
FB3  600R  [IND 0402_1005 RF WW]
J2  Conn_12_Male  [Conn_12_Male]
J3  CSP-USC16-TR  [VALCON_CSP-USC16-TR]
J4  Conn_16_Male  [CONN_16_MALE]
J5  MicroSD-MLX  [MOLEX-MicroSd]
R10  10k  [RES 0201_0603]
R11  1.5k  [RES 0201_0603]
R12  20R  [RES 0201_0603]
R13  10k  [RES 0201_0603]
R14  20R  [RES 0201_0603]
R15  5.1k  [RES 0201_0603]
R16  5.1k  [RES 0201_0603]
R17  10k  [RES 0201_0603]
R18  51R  [RES 0201_0603]
R19  51R  [RES 0201_0603]
R20  51R  [RES 0201_0603]
R21  10k  [RES 0201_0603]
R22  5.1k  [RES 0201_0603]
R23  51R  [RES 0201_0603]
R24  51R  [RES 0201_0603]
R25  51R  [RES 0201_0603]
R26  1.5k  [RES 0201_0603]
R27  4.7k  [RES 0201_0603]
R28  4.7k  [RES 0201_0603]
R29  3.57k  [RES 0201_0603]
R30  10k  [RES 0201_0603]
R31  10k  [RES 0201_0603]
R32  10k  [RES 0201_0603]
R33  10k  [RES 0201_0603]
R34  10k  [RES 0201_0603]
SW1  PTS810  [PCBComponent_1]
U4  74HC4067BQ  [QFN50P550X350X100-25N410X210]

### Blocks framed on the sheet
Onboard rails connected to the ADC: R10 R13

### Nets
GND: C22.1 C23.1 C24.1 C25.1 C26.1 J3.A1(GND_A) J3.A12(GND_A) J3.B1(GND_B) J3.B12(GND_B) J3.S1(SHELL_GND) J3.S2(SHELL_GND) J3.S3(SHELL_GND) J3.S4(SHELL_GND) J4.4 J4.16 J5.6(VSS) J5.11(SHLD1) J5.12(SHLD2) R13.1 R15.1 R16.1 R21.1 SW1.1 SW1.2 U4.9(Y0) U4.12(GND) U4.20(Y11) U4.21(Y10) U4.22(Y9)
A0: J4.5 R18.2 U4.8(Y1)
A1: J4.6 R23.2 U4.7(Y2)
A2: J4.7 R19.2 U4.6(Y3)
A3: J4.8 R24.2 U4.5(Y4)
A4: J4.9 R20.2 U4.4(Y5)
A5: J4.10 R25.2 U4.3(Y6)
ADC_CTRL0: R22.1
ADC_CTRL1: U4.15(~{E})
ADC_MUX0: U4.10(S0)
ADC_MUX1: U4.11(S1)
ADC_MUX2: U4.14(S2)
ADC_MUX3: U4.13(S3)
ADC_SENSE_HI: R17.2 R21.2
ADC_SENSE_LO: C22.2 R22.2
AREF: C23.2 J4.3 U4.2(Y7)
EN: J2.2
FPGA_RESET: J4.1
IO_0: J4.14
IO_1: J4.15
IO_5: J2.10
IO_6: J2.9
IO_9: J2.8
IO_10: J2.7
IO_11: J2.6
IO_12: J2.5
IO_13: J2.4
IO_A0: R18.1
IO_A1: R23.1
IO_A2: R19.1
IO_A3: R24.1
IO_A4: R20.1
IO_A5: R25.1
IO_MISO: J4.13
IO_MOSI: J4.12
IO_SCK: J4.11
IO_SCL: J2.11
IO_SDA: J2.12
LED_B: R29.2
LED_G: R27.2
LED_R: R26.2
P1V1: U4.17(Y14)
P1V35: R28.2 U4.19(Y12)
P2V5: U4.18(Y13)
P3V3: D1.4(A3) FB3.1 J4.2 R30.2 R31.2 R32.2 R33.2 R34.2 U4.23(Y8) U4.24(VCC)
PUSB_VBUS: J2.3 J3.A4(VBUS_A) J3.A9(VBUS_A) J3.B4(VBUS_B) J3.B9(VBUS_B)
SD0_CD: J5.9(CD_A) R34.1
SD0_CLK: J5.5(CLK)
SD0_CMD: J5.3(CMD) R32.1
SD0_DAT0: J5.7(DAT0) R31.1
SD0_DAT1: J5.8(DAT1) R30.1
SD0_DAT2: J5.1(DAT2) R33.1
SD0_DAT3: J5.2(CD/DAT3)
USB_D+: R11.2 R12.1
USB_D-: R14.1
USB_D_N: J3.A7(DN1) J3.B7(DN2) R14.2
USB_D_P: J3.A6(DP1) J3.B6(DP2) R12.2
USB_PULLUP: R11.1
USER_BUTTON: C26.2 R28.1 SW1.3 SW1.4
VBATT: J2.1 R10.2
NetC24_2: C24.2 C25.2 FB3.2 J5.4(VDD)
NetD1_1: D1.1(C1) R26.1
NetD1_2: D1.2(C2) R27.1
NetD1_3: D1.3(C3) R29.1
NetJ3_A5: J3.A5(CC1) R16.2
NetJ3_B5: J3.B5(CC2) R15.2
NetR10_1: R10.1 R13.2 U4.16(Y15)
NetR17_1: R17.1 U4.1(Z)

Not connected (* = marked no-connect by the designer): J3 A8(SBU1)* B8(SBU2)*; J5 10(CD_B)*; U4 25(EP)*

### Layout directives
differential pair: USB_D_N, USB_D_P

### Notes on the sheet
- (near J2) Feather I/O
- (near J2) VBAT (3 - 4.2V)
- (near J2) EN
- (near J3) USB Input
- (near J2) VBUS (4.5-5.5V)
- (near J2) I/O
- (near J2) I/O - SCL
- (near J2) I/O - SDA
- (near J4) RESET
- (near J4) +3V3
- (near J4) AREF
- (near J4) GND
- (near J4) ANALOG 0
- (near J4) ANALOG 1
- (near J4) ANALOG 2
- (near J4) ANALOG 3
- (near J4) ANALOG 4
- (near J4) ANALOG 5
- (near J4) I/O - SCK
- (near J4) I/O - MOSI
- (near J4) I/O - MISO
- (near J4) I/O - RX
- (near J4) I/O - TX
- (near J4) I/O
- Title
- Size:
- Date:
- A4
- Enginner:
- Time:
- Revision:
- Sheet
- of
- Author:
- File:
- (in symbol MicroSD-MLX) CD/; DAT3; SHLD; SD CARD

### Library data of the parts
C22-C24 = GRT033C80J104KE01J: as C2 on sheet 02-FPGA_Banks; Part Number: GRT033C80J104KE01J; Value: 100nF; Applications: Automotive; componentlink1description: Datasheet; componentlink1url: https://search.murata.co.jp/Ceramy/image/img/A01X/G101/ENG/GRT033C80J104KE01-01.pdf; componentlink2description: DigiKey Link; componentlink2url: https://www.digikey.com/en/products/detail/murata-electronics/GRT033C80J104KE01J/13905086; Device Package: 0201 (0603 Metric); lastupdated: 3/01/2023 8:00:58 p. m.; Lifecycle Status: Active; Minimum Order: 1; Mounting Type: Surface Mount, MLCC; Operating Temperature: -55°C ~ 105°C; Package / Case: 0201 (0603 Metric); packaging: CutTape; partid: 29730; Part Status: Active; price: 0.01; Ratings: AEC-Q200; series: GRT; Size / Dimension: 0.024" L x 0.012" W (0.60mm x 0.30mm); Supplier 1: DigiKey; Supplier Part Number 1: 490-GRT033C80J104KE01JCT-ND; Temperature Coefficient: X6S; Thickness (Max): 0.013" (0.33mm); Voltage - Rated: 6.3V
C25 = CL05A106MP8NUB8: CAP CER 10UF 10V X5R 0402; manufacturer: Samsung Electro-Mechanics; Tolerance: ±20%; Part Number: CL05A106MP8NUB8; Value: 10 µF; Applications: Acoustic Noise Reduction; Capacitance: 10 µF; componentlink1description: Datasheet; componentlink1url: http://www.samsungsem.com/kr/support/product-search/mlcc/CL05A106MP8NUB8.jsp; componentlink2description: DigiKey Link; componentlink2url: https://www.digikey.com/en/products/detail/samsung-electro-mechanics/CL05A106MP8NUB8/5961314; Device Package: 0402 (1005 Metric); lastupdated: 3/01/2023 8:04:20 p. m.; Lifecycle Status: Active; Minimum Order: 1; Mounting Type: Surface Mount, MLCC; Operating Temperature: -55°C ~ 85°C; Package / Case: 0402 (1005 Metric); packaging: TapeAndReel; partid: 1758; Part Status: Active; price: 0.06; series: CL; Size / Dimension: 0.039" L x 0.020" W (1.00mm x 0.50mm); Supplier 1: DigiKey; Supplier Part Number 1: 1276-6830-1-ND; Temperature Coefficient: X5R; Thickness (Max): 0.035" (0.90mm); Voltage - Rated: 10V
C26 = 0201ZC103JAT2A: as C1 on sheet 02-FPGA_Banks; Part Number: 0201ZC103JAT2A; Value: 10nF; Applications: General Purpose; Capacitance: 10000pF; componentlink1description: Datasheet; componentlink1url: http://datasheets.avx.com/X7RDielectric.pdf; componentlink2description: DigiKey Link; componentlink2url: http://digikey.com/product-detail/en/avx-corporation/0201ZC103JAT2A/478-10776-1-ND/7536320; Device Package: 0201 (0603 Metric); lastupdated: 2/09/2020 12:59:12 a. m.; Lifecycle Status: Active; Minimum Order: 1; Mounting Type: Surface Mount, MLCC; Operating Temperature: -55°C ~ 125°C; Package / Case: 0201 (0603 Metric); packaging: TapeAndReel; partid: 786; Part Status: Active; price: 0.01; series: -; Size / Dimension: 0.024" L x 0.012" W (0.60mm x 0.30mm); Supplier 1: DigiKey; Supplier Part Number 1: 478-10776-1-ND; Temperature Coefficient: X7R; Thickness (Max): 0.013" (0.33mm); Voltage - Rated: 10V
D1 = CL-505S-X-SD-T: LED TRI TOP FIRING 1.0 X 1.0; Manufacturer: Citizen; Configuration: Common Anode; Current - Test: 5mA Red, 5mA Green, 5mA Blue; Lens Color: 0.26mm; Lens Size: 1.00mm; Lens Style: Square with Flat Top; Millicandela Rating: 40mcd Red, 220mcd Green, 65mcd Blue; Voltage - Forward (Vf) (Typ): 1.85V Red, 2.7V Green, 2.75V Blue; Wavelength - Dominant: 615nm Red, 530nm Green, 470nm Blue; Part Number: CL-505S-X-SD-T; Color: Red, Green, Blue (RGB); ComponentLink1Description: Datasheet; ComponentLink1URL: http://ce.citizen.co.jp/up_img/product/sQNrj4RlM7o2/CL-505S_e.pdf; ComponentLink2Description: DigiKey Link; ComponentLink2URL: http://digikey.com/product-detail/en/citizen/CL-505S-X-SD-T/1642-1510-1-ND/6005950; Device Package: 0404 (1010 Metric); Height (Max): 0.26mm; LastUpdated: 19/03/2020 10:25:23 p. m.; Lifecycle Status: Active; Minimum Order: 1; Mounting Type: Surface Mount; Package / Case: 0404 (1010 Metric); Packaging: TapeAndReel; PartId: 955; Part Status: Active; Price: 0.23; Series: CL-505S; Size / Dimension: 1.00mm L x 1.00mm W; Supplier 1: DigiKey; Supplier Part Number 1: 1642-1510-1-ND; Value: Red, Green, Blue (RGB)
FB3 = LQW15AN4N8D8ZD: as FB1 on sheet 03-DRAM_Memory; Part Number: LQW15AN4N8D8ZD; ComponentLink1Description: Datasheet; ComponentLink1URL: https://search.murata.co.jp/Ceramy/image/img/P02/JELF243A-9138.pdf; ComponentLink2Description: DigiKey Link; ComponentLink2URL: https://www.digikey.com/en/products/detail/murata-electronics/LQW15AN4N8D8ZD/6798910; Current Rating (Amps): 1.2 A; Device Package: 0402 (1005 Metric); Height - Seated (Max): 0.024" (0.60mm); Inductance: 4.8 nH; LastUpdated: 2/01/2023 8:59:34 p. m.; Lifecycle Status: Active; Minimum Order: 1; Mounting Type: Surface Mount; Operating Temperature: -55°C ~ 125°C; Package / Case: 0402 (1005 Metric); Packaging: TapeAndReel; PartId: 2; Part Status: Active; Price: 0.08; Ratings: AEC-Q200; Series: LQW15; Size / Dimension: 0.039" L x 0.024" W (1.00mm x 0.60mm); Supplier 1: DigiKey; Supplier Part Number 1: 490-15485-1-ND; Value: 600R
J2 = Conn_12_Male: Conn_01x12_Male
J3 = CSP-USC16-TR: CSP-USC16-TR Valcon USB Type C Surface Mount PCB Socket; Package: None; Purchase-URL: https://pricing.snapeda.com/search/part/CSP-USC16-TR/?ref=eda; MP: CSP-USC16-TR; Check_prices: https://www.snapeda.com/parts/CSP-USC16-TR/Valcon/view-part/4783629/?ref=eda; MF: Valcon; Value: *; Availability: No availability data; Price: None; SnapEDA_Link: https://www.snapeda.com/parts/CSP-USC16-TR/Valcon/view-part/4783629/?ref=snap
J4 = Conn_16_Male: Conn_01x16_Male
J5 = MicroSD-MLX: Micro SD Card, RA, -25 to 85 degC, 8-Pin SMD, RoHS
R10-R34 = ERA-1AEB103C: as R1 on sheet 01-FPGA_Sources; Part Number: ERA-1AEB103C; ComponentLink1Description: Datasheet; ComponentLink1URL: https://industrial.panasonic.com/cdbs/www-data/pdf/RDM0000/AOA0000C307.pdf; ComponentLink2Description: DigiKey Link; ComponentLink2URL: https://www.digikey.com/en/products/detail/panasonic-electronic-components/ERA-1AEB103C/5035568; Composition: Thin Film; Device Package: 0201 (0603 Metric); Features: Automotive AEC-Q200; Height - Seated (Max): 0.010" (0.26mm); LastUpdated: 3/01/2023 8:15:23 p. m.; Lifecycle Status: Active; Minimum Order: 1; Number of Terminations: 2; Operating Temperature: -55°C ~ 155°C; Package / Case: 0201 (0603 Metric); Packaging: TapeAndReel; PartId: 598; Part Status: Active; Price: 0.06; Ratings: AEC-Q200; Series: ERA-1A; Size / Dimension: 0.024" L x 0.012" W (0.60mm x 0.30mm); Supplier 1: DigiKey; Supplier Part Number 1: P10KBXCT-ND; Supplier Device Package: 0201; Tolerance: ±0.1%
  R10 R13 R17 R21 R30-R34: Value: 10k
  R11 R26: Value: 1.5k
  R12 R14: Value: 20R
  R15 R16 R22: Value: 5.1k
  R18-R20 R23-R25: Value: 51R
  R27 R28: Value: 4.7k
  R29: Value: 3.57k
U4 = 74HC4067BQ: 1 Circuit IC Switch 16:1 120Ohm 24-DHVQFN _5.5x3.5_; MF: Nexperia USA; Availability: Unavailable; SnapEDA_Link: https://www.snapeda.com/parts/74HC4067BQ/Nexperia%20USA%20Inc./view-part/602696/?ref=snap; Price: None; Package: DHVQFN-24 Nexperia; MP: 74HC4067BQ; Value: *

## Sheet 05-Power_Sources.SchDoc
size A4; Author: Fabian Castaño; CompanyName: GIBIC Tech-Hub; Engineer: Fabian Castaño; Organization: Universidad de Antioquia; Address1: UdeA; Address2: Medellín; Address3: Antioquia; Address4: Colombia 050010
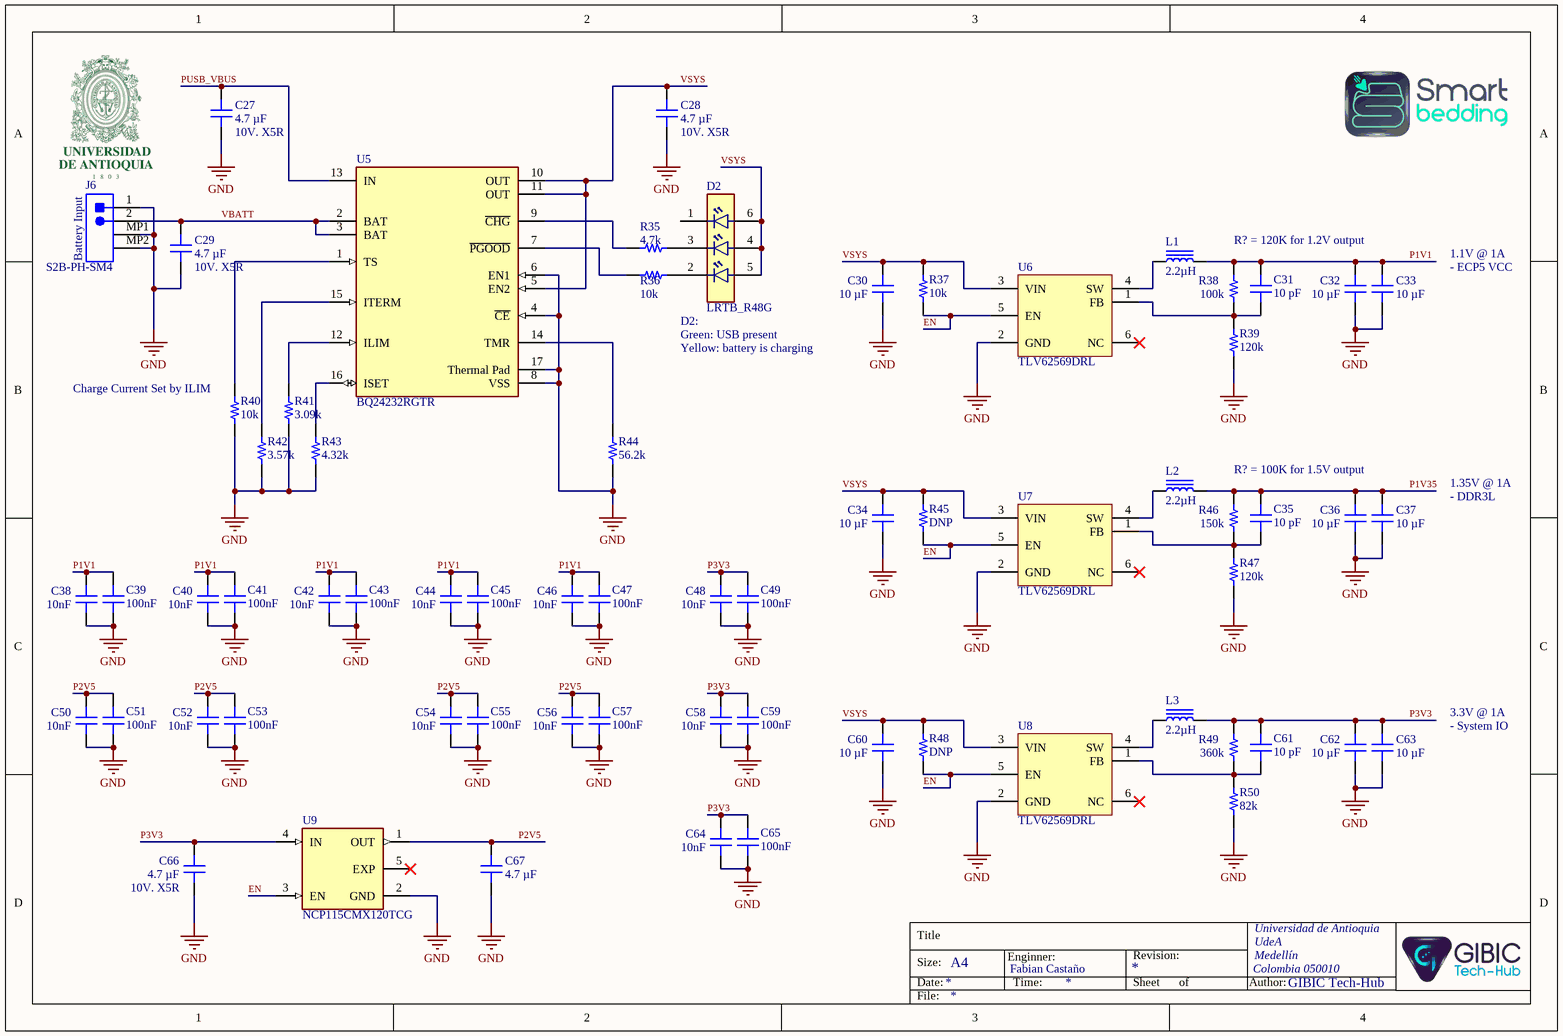
[diagram p5: 05-Power_Sources.SchDoc]

### Parts
C27  4.7 µF  Voltage: 10V. X5R  [CAP 0402_1005]
C28  4.7 µF  Voltage: 10V. X5R  [CAP 0402_1005]
C29  4.7 µF  Voltage: 10V. X5R  [CAP 0402_1005]
C30  10 µF  [CAP 0402_1005]
C31  10 pF  [CAP 0201_0603]
C32  10 µF  [CAP 0402_1005]
C33  10 µF  [CAP 0402_1005]
C34  10 µF  [CAP 0402_1005]
C35  10 pF  [CAP 0201_0603]
C36  10 µF  [CAP 0402_1005]
C37  10 µF  [CAP 0402_1005]
C38  10nF  [CAP 0201_0603]
C39  100nF  [CAP 0201_0603]
C40  10nF  [CAP 0201_0603]
C41  100nF  [CAP 0201_0603]
C42  10nF  [CAP 0201_0603]
C43  100nF  [CAP 0201_0603]
C44  10nF  [CAP 0201_0603]
C45  100nF  [CAP 0201_0603]
C46  10nF  [CAP 0201_0603]
C47  100nF  [CAP 0201_0603]
C48  10nF  [CAP 0201_0603]
C49  100nF  [CAP 0201_0603]
C50  10nF  [CAP 0201_0603]
C51  100nF  [CAP 0201_0603]
C52  10nF  [CAP 0201_0603]
C53  100nF  [CAP 0201_0603]
C54  10nF  [CAP 0201_0603]
C55  100nF  [CAP 0201_0603]
C56  10nF  [CAP 0201_0603]
C57  100nF  [CAP 0201_0603]
C58  10nF  [CAP 0201_0603]
C59  100nF  [CAP 0201_0603]
C60  10 µF  [CAP 0402_1005]
C61  10 pF  [CAP 0201_0603]
C62  10 µF  [CAP 0402_1005]
C63  10 µF  [CAP 0402_1005]
C64  10nF  [CAP 0201_0603]
C65  100nF  [CAP 0201_0603]
C66  4.7 µF  Voltage: 10V. X5R  [CAP 0402_1005]
C67  4.7 µF  [CAP 0402_1005]
D2  LRTB_R48G  [LRTB_R48G]
J6  S2B-PH-SM4  [JST-S2B-PH-SM4-TB(LF)(SN)-2_V]
L1  2.2µH  [IND 0806_2016]
L2  2.2µH  [IND 0806_2016]
L3  2.2µH  [IND 0806_2016]
R35  4.7k  [RES 0201_0603]
R36  10k  [RES 0201_0603]
R37  10k  [RES 0201_0603]
R38  100k  [RES 0201_0603]
R39  120k  [RES 0201_0603]
R40  10k  [RES 0201_0603]
R41  3.09k  [RES 0201_0603]
R42  3.57k  [RES 0201_0603]
R43  4.32k  [RES 0201_0603]
R44  56.2k  [RES 0201_0603]
R45  DNP  [RES 0201_0603]
R46  150k  [RES 0201_0603]
R47  120k  [RES 0201_0603]
R48  DNP  [RES 0201_0603]
R49  360k  [RES 0201_0603]
R50  82k  [RES 0201_0603]
U5  BQ24232RGTR  [FP-RGTR_MFG]
U6  TLV62569DRL  [SOT50P160X60-6N]
U7  TLV62569DRL  [SOT50P160X60-6N]
U8  TLV62569DRL  [SOT50P160X60-6N]
U9  NCP115CMX120TCG  [VREG_NCP115CMX120TCG]

### Nets
GND: C27.2 C28.2 C29.2 C30.1 C32.1 C33.1 C34.1 C36.1 C37.1 C38.1 C39.1 C40.1 C41.1 C42.1 C43.1 C44.1 C45.1 C46.1 C47.1 C48.1 C49.1 C50.1 C51.1 C52.1 C53.1 C54.1 C55.1 C56.1 C57.1 C58.1 C59.1 C60.1 C62.1 C63.1 C64.1 C65.1 C66.2 C67.2 J6.1 J6.MP1 J6.MP2 R39.1 R40.1 R41.1 R42.1 R43.1 R44.1 R47.1 R50.1 U5.4(~{CE}) U5.6(EN1) U5.8(VSS) U5.17(Thermal_Pad) U6.2(GND) U7.2(GND) U8.2(GND) U9.2(GND)
EN: R37.1 R45.1 R48.1 U6.5(EN) U7.5(EN) U8.5(EN) U9.3(EN)
P1V1: C31.2 C32.2 C33.2 C38.2 C39.2 C40.2 C41.2 C42.2 C43.2 C44.2 C45.2 C46.2 C47.2 L1.2 R38.2
P1V35: C35.2 C36.2 C37.2 L2.2 R46.2
P2V5: C50.2 C51.2 C52.2 C53.2 C54.2 C55.2 C56.2 C57.2 C67.1 U9.1(OUT)
P3V3: C48.2 C49.2 C58.2 C59.2 C61.2 C62.2 C63.2 C64.2 C65.2 C66.1 L3.2 R49.2 U9.4(IN)
PUSB_VBUS: C27.1 U5.13(IN)
VBATT: C29.1 J6.2 U5.2(BAT) U5.3(BAT)
VSYS: C28.1 C30.2 C34.2 C60.2 D2.4(RED_A) D2.5(GREEN_A) D2.6(BLUE_A) R37.2 R45.2 R48.2 U5.5(EN2) U5.10(OUT) U5.11(OUT) U6.3(VIN) U7.3(VIN) U8.3(VIN)
NetC31_1: C31.1 R38.1 R39.2 U6.1(FB)
NetC35_1: C35.1 R46.1 R47.2 U7.1(FB)
NetC61_1: C61.1 R49.1 R50.2 U8.1(FB)
NetD2_2: D2.2(GREEN_C) R36.1
NetD2_3: D2.3(RED_C) R35.1
NetL1_1: L1.1 U6.4(SW)
NetL2_1: L2.1 U7.4(SW)
NetL3_1: L3.1 U8.4(SW)
NetR35_2: R35.2 U5.9(~{CHG})
NetR36_2: R36.2 U5.7(~{PGOOD})
NetR40_2: R40.2 U5.1(TS)
NetR41_2: R41.2 U5.12(ILIM)
NetR42_2: R42.2 U5.15(ITERM)
NetR43_2: R43.2 U5.16(ISET)
NetR44_2: R44.2 U5.14(TMR)

Not connected (* = marked no-connect by the designer): D2 1(BLUE_C); U6 6(NC)*; U7 6(NC)*; U8 6(NC)*; U9 5(EXP)*

### Notes on the sheet
- R? = 120K for 1.2V output
- (near J6) Battery Input
- 1.1V @ 1A
- - ECP5 VCC
- D2:
- Green: USB present
- Yellow: battery is charging
- (near R40) Charge Current Set by ILIM
- R? = 100K for 1.5V output
- 1.35V @ 1A
- - DDR3L
- 3.3V @ 1A
- - System IO
- Title
- Size:
- Date:
- A4
- Enginner:
- Time:
- Revision:
- Sheet
- of
- Author:
- File:

### Library data of the parts
C27-C29 C66 C67 = C1005X6S0G475M050BC: CAP CER 4.7UF 4V X6S 0402; manufacturer: TDK Corporation; Tolerance: ±20%; Part Number: C1005X6S0G475M050BC; Value: 4.7 µF; Applications: General Purpose; Capacitance: 4.7 µF; componentlink1description: Datasheet; componentlink1url: https://product.tdk.com/info/en/catalog/datasheets/mlcc_commercial_general_en.pdf?ref_disty=digikey; componentlink2description: DigiKey Link; componentlink2url: https://www.digikey.com/en/products/detail/tdk-corporation/C1005X6S0G475M050BC/2792242; Device Package: 0402 (1005 Metric); Features: Low ESL; lastupdated: 3/01/2023 8:04:20 p. m.; Lifecycle Status: Active; Minimum Order: 1; Mounting Type: Surface Mount, MLCC; Operating Temperature: -55°C ~ 105°C; Package / Case: 0402 (1005 Metric); packaging: TapeAndReel; partid: 1756; Part Status: Active; price: 0.07; series: C; Size / Dimension: 0.039" L x 0.020" W (1.00mm x 0.50mm); Supplier 1: DigiKey; Supplier Part Number 1: 445-8017-1-ND; Temperature Coefficient: X6S; Thickness (Max): 0.026" (0.65mm); Voltage - Rated: 4V
C30 C32-C34 C36 C37 C60 C62 C63 = CL05A106MP8NUB8: as C25 on sheet 04-External_Connectors; Part Number: CL05A106MP8NUB8; Value: 10 µF; Applications: Acoustic Noise Reduction; Capacitance: 10 µF; componentlink1description: Datasheet; componentlink1url: http://www.samsungsem.com/kr/support/product-search/mlcc/CL05A106MP8NUB8.jsp; componentlink2description: DigiKey Link; componentlink2url: https://www.digikey.com/en/products/detail/samsung-electro-mechanics/CL05A106MP8NUB8/5961314; Device Package: 0402 (1005 Metric); lastupdated: 3/01/2023 8:04:20 p. m.; Lifecycle Status: Active; Minimum Order: 1; Mounting Type: Surface Mount, MLCC; Operating Temperature: -55°C ~ 85°C; Package / Case: 0402 (1005 Metric); packaging: TapeAndReel; partid: 1758; Part Status: Active; price: 0.06; series: CL; Size / Dimension: 0.039" L x 0.020" W (1.00mm x 0.50mm); Supplier 1: DigiKey; Supplier Part Number 1: 1276-6830-1-ND; Temperature Coefficient: X5R; Thickness (Max): 0.035" (0.90mm); Voltage - Rated: 10V
C31 C35 C61 = C0201C100J3GAC7867: CAP CER 10PF 25V C0G/NP0 0201; manufacturer: KEMET; Temperature Coefficient: C0G, NP0; Tolerance: ±5%; Part Number: C0201C100J3GAC7867; Value: 10 pF; Applications: General Purpose; Capacitance: 10 pF; componentlink1description: Datasheet; componentlink1url: https://api.kemet.com/component-edge/download/datasheet/C0201C100J3GAC7867.pdf; componentlink2description: DigiKey Link; componentlink2url: https://www.digikey.com/en/products/detail/kemet/C0201C100J3GAC7867/7381972; Device Package: 0201 (0603 Metric); Features: Low ESL; lastupdated: 3/01/2023 8:01:19 p. m.; Lifecycle Status: Active; Minimum Order: 1; Mounting Type: Surface Mount, MLCC; Operating Temperature: -55°C ~ 125°C; Package / Case: 0201 (0603 Metric); packaging: TapeAndReel; partid: 4; Part Status: Active; price: 0.02; series: SMD Comm C0G; Size / Dimension: 0.024" L x 0.012" W (0.60mm x 0.30mm); Supplier 1: DigiKey; Supplier Part Number 1: 399-14856-1-ND; Thickness (Max): 0.013" (0.33mm); Voltage - Rated: 25V
C38 C40 C42 C44 C46 C48 C50 C52 C54 C56 C58 C64 = 0201ZC103JAT2A: as C1 on sheet 02-FPGA_Banks; Part Number: 0201ZC103JAT2A; Value: 10nF; Applications: General Purpose; Capacitance: 10000pF; componentlink1description: Datasheet; componentlink1url: http://datasheets.avx.com/X7RDielectric.pdf; componentlink2description: DigiKey Link; componentlink2url: http://digikey.com/product-detail/en/avx-corporation/0201ZC103JAT2A/478-10776-1-ND/7536320; Device Package: 0201 (0603 Metric); lastupdated: 2/09/2020 12:59:12 a. m.; Lifecycle Status: Active; Minimum Order: 1; Mounting Type: Surface Mount, MLCC; Operating Temperature: -55°C ~ 125°C; Package / Case: 0201 (0603 Metric); packaging: TapeAndReel; partid: 786; Part Status: Active; price: 0.01; series: -; Size / Dimension: 0.024" L x 0.012" W (0.60mm x 0.30mm); Supplier 1: DigiKey; Supplier Part Number 1: 478-10776-1-ND; Temperature Coefficient: X7R; Thickness (Max): 0.013" (0.33mm); Voltage - Rated: 10V
C39 C41 C43 C45 C47 C49 C51 C53 C55 C57 C59 C65 = GRT033C80J104KE01J: as C2 on sheet 02-FPGA_Banks; Part Number: GRT033C80J104KE01J; Value: 100nF; Applications: Automotive; componentlink1description: Datasheet; componentlink1url: https://search.murata.co.jp/Ceramy/image/img/A01X/G101/ENG/GRT033C80J104KE01-01.pdf; componentlink2description: DigiKey Link; componentlink2url: https://www.digikey.com/en/products/detail/murata-electronics/GRT033C80J104KE01J/13905086; Device Package: 0201 (0603 Metric); lastupdated: 3/01/2023 8:00:58 p. m.; Lifecycle Status: Active; Minimum Order: 1; Mounting Type: Surface Mount, MLCC; Operating Temperature: -55°C ~ 105°C; Package / Case: 0201 (0603 Metric); packaging: CutTape; partid: 29730; Part Status: Active; price: 0.01; Ratings: AEC-Q200; series: GRT; Size / Dimension: 0.024" L x 0.012" W (0.60mm x 0.30mm); Supplier 1: DigiKey; Supplier Part Number 1: 490-GRT033C80J104KE01JCT-ND; Temperature Coefficient: X6S; Thickness (Max): 0.013" (0.33mm); Voltage - Rated: 6.3V
D2 = LRTB_R48G: RGB LED LRTB R48G
J6 = S2B-PH-SM4: Male Header, Pitch 2 mm, 1 x 2 Position, Height 5.5 mm
L1-L3 = ASMPM-0806-2R2M-T: FIXED IND 2.2UH 1.4A 168MOHM; Manufacturer: Abracon LLC; Current Rating (Amps): 1.6A; Current - Saturation: 2A; DC Resistance (DCR): 168mOhm Max; Inductance Frequency - Test: 100kHz; Material - Core: Ceramic; Shielding: Unshielded; Tolerance: ±20%; Type: Multilayer; Part Number: ASMPM-0806-2R2M-T; ComponentLink1Description: Datasheet; ComponentLink1URL: https://abracon.com/Magnetics/power/ASMPM.pdf; ComponentLink2Description: DigiKey Link; ComponentLink2URL: http://digikey.com/product-detail/en/abracon-llc/ASMPM-0806-2R2M-T/535-14172-1-ND/8259990; Device Package: 0806 (2016 Metric); Height - Seated (Max): 0.039" (1.00mm); Inductance: 2.2µH; LastUpdated: 2/01/2023 9:04:13 p. m.; Lifecycle Status: Active; Minimum Order: 0; Mounting Type: Surface Mount; Operating Temperature: -40°C ~ 125°C; Package / Case: 0806 (2016 Metric); Packaging: TapeAndReel; PartId: 3058; Part Status: Active; Price: 0.14; Series: ASMPM; Size / Dimension: 0.079" L x 0.063" W (2.00mm x 1.60mm); Supplier 1: DigiKey; Supplier Part Number 1: 535-14172-1-ND; Supplier Device Package: 0806 (2016 Metric); Value: 2.2µH
R35-R37 R40-R45 R48 = ERA-1AEB103C: as R1 on sheet 01-FPGA_Sources; Part Number: ERA-1AEB103C; ComponentLink1Description: Datasheet; ComponentLink1URL: https://industrial.panasonic.com/cdbs/www-data/pdf/RDM0000/AOA0000C307.pdf; ComponentLink2Description: DigiKey Link; ComponentLink2URL: https://www.digikey.com/en/products/detail/panasonic-electronic-components/ERA-1AEB103C/5035568; Composition: Thin Film; Device Package: 0201 (0603 Metric); Features: Automotive AEC-Q200; Height - Seated (Max): 0.010" (0.26mm); LastUpdated: 3/01/2023 8:15:23 p. m.; Lifecycle Status: Active; Minimum Order: 1; Number of Terminations: 2; Operating Temperature: -55°C ~ 155°C; Package / Case: 0201 (0603 Metric); Packaging: TapeAndReel; PartId: 598; Part Status: Active; Price: 0.06; Ratings: AEC-Q200; Series: ERA-1A; Size / Dimension: 0.024" L x 0.012" W (0.60mm x 0.30mm); Supplier 1: DigiKey; Supplier Part Number 1: P10KBXCT-ND; Supplier Device Package: 0201; Tolerance: ±0.1%
  R35: Value: 4.7k
  R36 R37 R40: Value: 10k
  R41: Value: 3.09k
  R42: Value: 3.57k
  R43: Value: 4.32k
  R44: Value: 56.2k
  R45 R48: Value: DNP
R38 R39 R46 R47 R49 R50 = PFR03S-104-JNH: RES SMD 100K OHM 5% 1/20W 0201; Manufacturer: Delta Electronics/Cyntec; Power (Watts): 0.05W, 1/20W; Resistance: 100 kOhms; Temperature Coefficient: ±200ppm/°C; Part Number: PFR03S-104-JNH; ComponentLink1Description: Datasheet; ComponentLink1URL: http://www.cyntec.com/upfile/products/download/RK000000NH%20_A4_PFR03S.pdf; ComponentLink2Description: DigiKey Link; ComponentLink2URL: https://www.digikey.com/en/products/detail/delta-electronics-cyntec/PFR03S-104-JNH/9761665; Composition: Thick Film; Device Package: 0201 (0603 Metric); Height - Seated (Max): 0.010" (0.26mm); LastUpdated: 3/01/2023 8:15:21 p. m.; Lifecycle Status: Active; Minimum Order: 1; Number of Terminations: 2; Operating Temperature: -55°C ~ 125°C; Package / Case: 0201 (0603 Metric); Packaging: CutTape; PartId: 917; Part Status: Active; Price: 0.01; Series: PFR03S; Size / Dimension: 0.024" L x 0.012" W (0.60mm x 0.30mm); Supplier 1: DigiKey; Supplier Part Number 1: 2037-PFR03S-104-JNHCT-ND; Supplier Device Package: 0201; Tolerance: ±5%
  R38: Value: 100k
  R39 R47: Value: 120k
  R46: Value: 150k
  R49: Value: 360k
  R50: Value: 82k
U5 = BQ24232RGTR: IC LI-ION CHARGE PWR MGMT 16QFN BQ24232RGTR
U6-U8 = TLV62569DRL: 2.5V-5.5V input, 2-A high efficiency step-down buck converter in SOT23 and SOT563 package
U9 = NCP115CMX120TCG: Linear Voltage Regulator IC Positive Fixed 1 Output 300mA 4-XDFN (1x1); MF: ON Semiconductor; MP: NCP115CMX120TCG; Purchase-URL: https://pricing.snapeda.com/search/part/NCP115CMX120TCG/?ref=eda; SnapEDA_Link: https://www.snapeda.com/parts/NCP115CMX120TCG/Onsemi/view-part/?ref=snap; Price: None; Package: XDFN-4 ON Semiconductor; Value: *; Check_prices: https://www.snapeda.com/parts/NCP115CMX120TCG/Onsemi/view-part/?ref=eda; Availability: In Stock